# Altium schematic sheet dk-lock-power.SchDoc
size A4
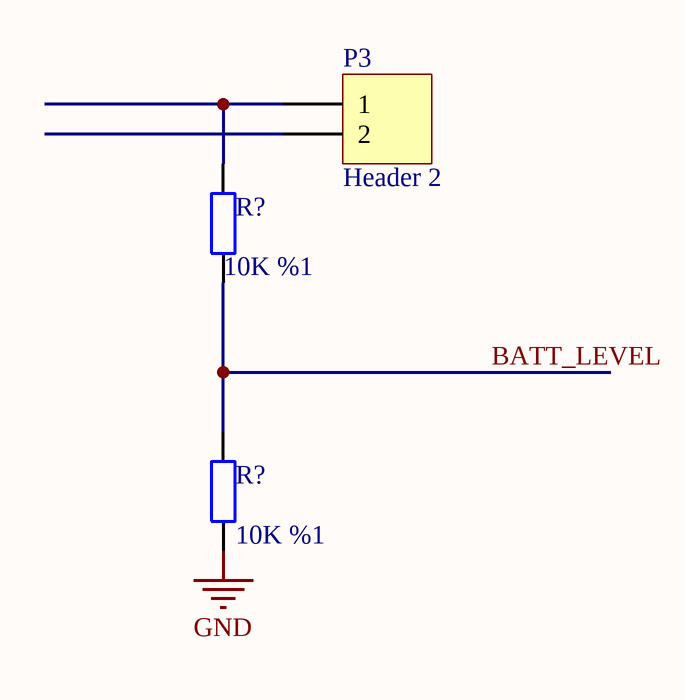
[diagram p0: dk-lock-power.SchDoc]

## Parts
(Parts that share a designator on the sheet are numbered #1, #2 ... from top to bottom, then left to right.)
P3  Header 2  [HDR1X2]
R?#1  value 10K %1  [AXIAL-0.4]  (hidden comment: Res2)
R?#2  value 10K %1  [AXIAL-0.4]  (hidden comment: Res2)

## Nets
GND: R?#2.2
BATT_LEVEL: R?#1.1 R?#2.1
NetP3_1: P3.1 R?#1.2

Not connected (* = marked no-connect by the designer): P3 2

## Library data of the parts
P3 = Header 2: Header, 2-Pin; LatestRevisionDate: 17-Jul-2002; LatestRevisionNote: Re-released for DXP Platform.; Publisher: Altium Limited
R?#1 R?#2 = Res2: Resistor; Published: 8-Jun-2000; LatestRevisionDate: 17-Jul-2002; LatestRevisionNote: Re-released for DXP Platform.; PackageReference: AXIAL-0.4; Publisher: Altium Limited; PackageDescription: Axial Device, Thru-Hole; 2 Leads; 0.4 in Pin Spacing